# Altium schematic sheet Sheet2.SchDoc
size A; DrawnBy: Devansh; SheetNumber: 2; SheetTotal: 3
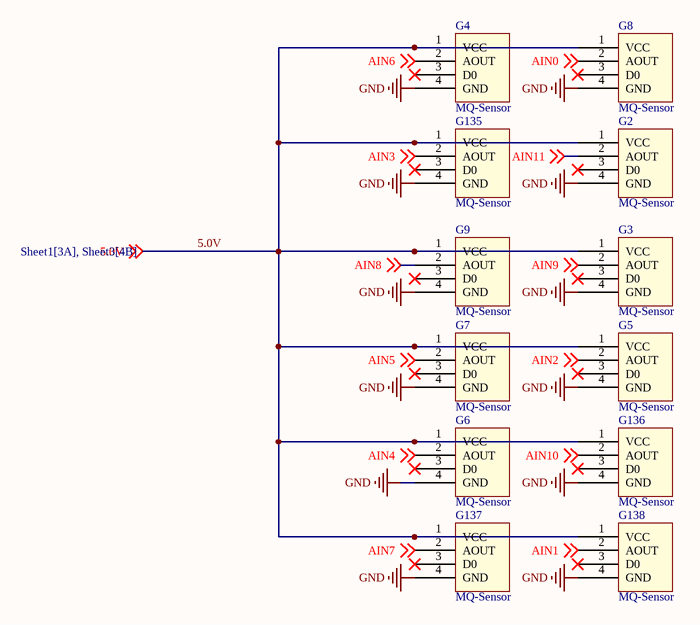
[diagram p0: Sheet2.SchDoc]

## Parts
G2  MQ-Sensor  [MQ-FOOTPRINT-B]
G3  MQ-Sensor  [MQ-FOOTPRINT-B]
G4  MQ-Sensor  [MQ-FOOTPRINT-B]
G5  MQ-Sensor  [MQ-FOOTPRINT-B]
G6  MQ-Sensor  [MQ-FOOTPRINT-B]
G7  MQ-Sensor  [MQ-FOOTPRINT-B]
G8  MQ-Sensor  [MQ-FOOTPRINT-B]
G9  MQ-Sensor  [MQ-FOOTPRINT-B]
G135  MQ-Sensor  [MQ-FOOTPRINT-B]
G136  MQ-Sensor  [MQ-Footprint-A]
G137  MQ-Sensor  [MQ-Footprint-A]
G138  MQ-Sensor  [MQ-FOOTPRINT-C]

## Nets
GND: G2.4(GND) G3.4(GND) G4.4(GND) G5.4(GND) G6.4(GND) G7.4(GND) G8.4(GND) G9.4(GND) G135.4(GND) G136.4(GND) G137.4(GND) G138.4(GND)
5.0V: G2.1(VCC) G3.1(VCC) G4.1(VCC) G5.1(VCC) G6.1(VCC) G7.1(VCC) G8.1(VCC) G9.1(VCC) G135.1(VCC) G136.1(VCC) G137.1(VCC) G138.1(VCC) ; off-sheet 5.0V
AIN0: G8.2(AOUT) ; off-sheet AIN0
AIN1: G138.2(AOUT) ; off-sheet AIN1
AIN2: G5.2(AOUT) ; off-sheet AIN2
AIN3: G135.2(AOUT) ; off-sheet AIN3
AIN4: G6.2(AOUT) ; off-sheet AIN4
AIN5: G7.2(AOUT) ; off-sheet AIN5
AIN6: G4.2(AOUT) ; off-sheet AIN6
AIN7: G137.2(AOUT) ; off-sheet AIN7
AIN8: G9.2(AOUT) ; off-sheet AIN8
AIN9: G3.2(AOUT) ; off-sheet AIN9
AIN10: G136.2(AOUT) ; off-sheet AIN10
AIN11: G2.2(AOUT) ; off-sheet AIN11

Not connected (* = marked no-connect by the designer): G2 3(D0)*; G3 3(D0)*; G4 3(D0)*; G5 3(D0)*; G6 3(D0)*; G7 3(D0)*; G8 3(D0)*; G9 3(D0)*; G135 3(D0)*; G136 3(D0)*; G137 3(D0)*; G138 3(D0)*